# Altium schematic sheet Bottom Layer.SchDoc
size A
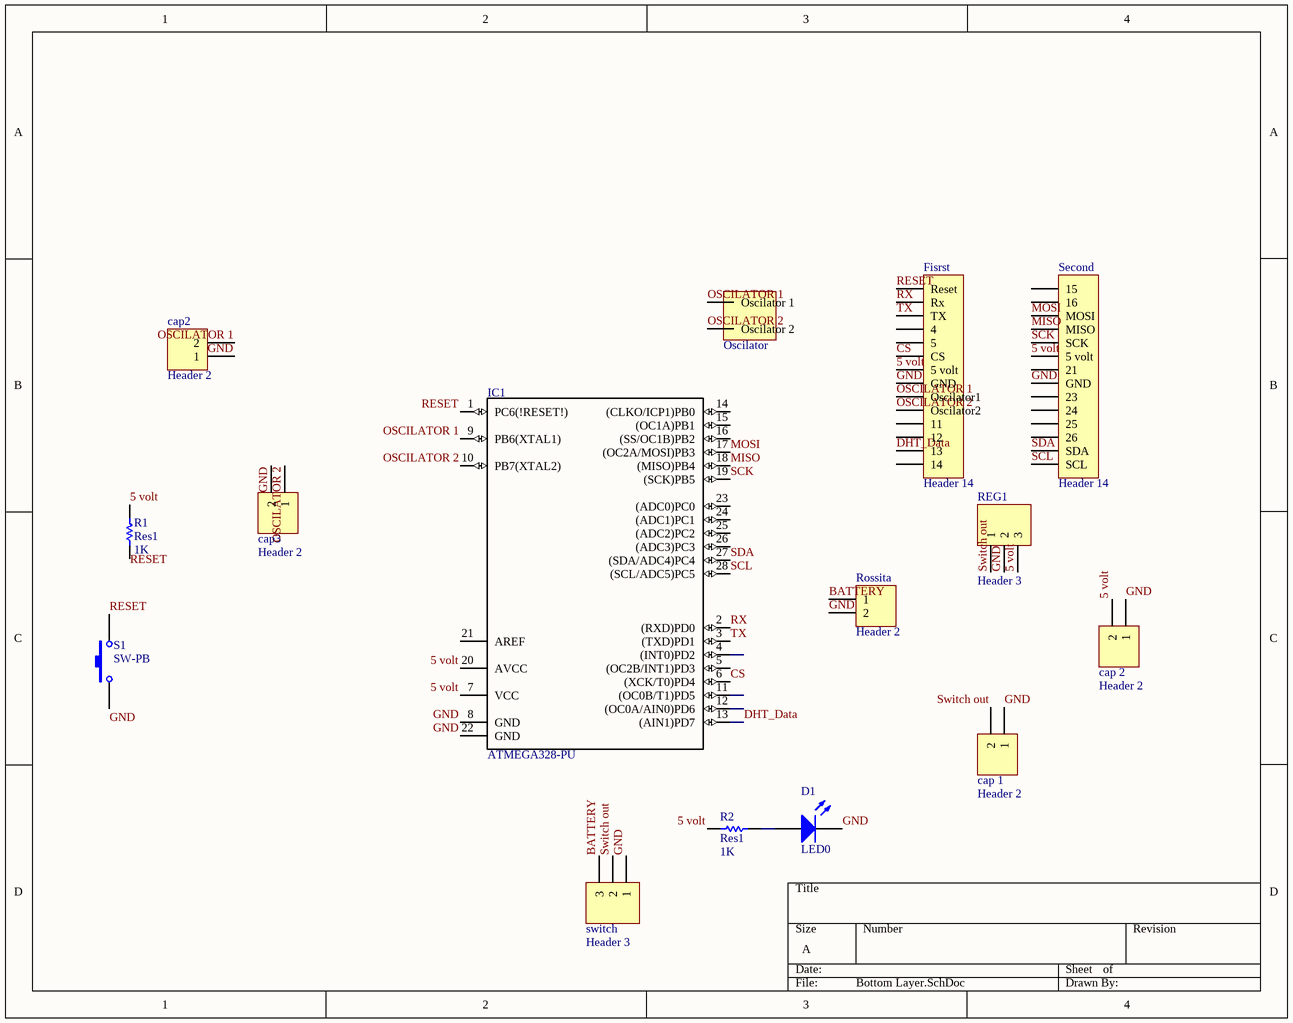
[diagram p0: Bottom Layer.SchDoc]

## Parts
cap2  Header 2  [HDR1X2]
cap3  Header 2  [HDR1X2]
cap_1  Header 2  [HDR1X2]
cap_2  Header 2  [HDR1X2]
D1  LED0  [LED-0]
Fisrst  Header 14  [HDR1X14]
IC1  ATMEGA328-PU  [*DIL28]
Oscilator1  Oscilator  [Oscilator]
R1  Res1  value 1K  [AXIAL-0.3]
R2  Res1  value 1K  [AXIAL-0.3]
REG1  Header 3  [HDR1X3]
Rossita  Header 2  [HDR1X2]
S1  SW-PB  [SPST-2]
Second  Header 14  [HDR1X14]
switch  Header 3  [HDR1X3]

## Nets
5 volt: cap_2.2 Fisrst.7(5_volt) IC1.7(VCC) IC1.20(AVCC) R1.2 R2.1 REG1.3 Second.6(5_volt)
BATTERY: Rossita.1 switch.3
CS: Fisrst.6(CS) IC1.6((XCK/T0)PD4)
DHT_Data: Fisrst.13 IC1.13((AIN1)PD7)
GND: cap2.1 cap3.2 cap_1.1 cap_2.1 D1.2(K) Fisrst.8(GND) IC1.8(GND) IC1.22(GND) REG1.2 Rossita.2 S1.1 Second.8(GND) switch.1
MISO: IC1.18((MISO)PB4) Second.4(MISO)
MOSI: IC1.17((OC2A/MOSI)PB3) Second.3(MOSI)
OSCILATOR 1: cap2.2 Fisrst.9(Oscilator1) IC1.9(PB6(XTAL1)) Oscilator1.Oscilator1(Oscilator_1)
OSCILATOR 2: cap3.1 Fisrst.10(Oscilator2) IC1.10(PB7(XTAL2)) Oscilator1.Oscilator2(Oscilator_2)
RESET: Fisrst.1(Reset) IC1.1(PC6(!RESET!)) R1.1 S1.2
RX: Fisrst.2(Rx) IC1.2((RXD)PD0)
SCK: IC1.19((SCK)PB5) Second.5(SCK)
SCL: IC1.28((SCL/ADC5)PC5) Second.14(SCL)
SDA: IC1.27((SDA/ADC4)PC4) Second.13(SDA)
Switch out: cap_1.2 REG1.1 switch.2
TX: Fisrst.3(TX) IC1.3((TXD)PD1)
NetD1_1: D1.1(A) R2.2

Not connected (* = marked no-connect by the designer): Fisrst 4 5 11 12 14; IC1 4((INT0)PD2) 5((OC2B/INT1)PD3) 11((OC0B/T1)PD5) 12((OC0A/AIN0)PD6) 14((CLKO/ICP1)PB0) 15((OC1A)PB1) 16((SS/OC1B)PB2) 21(AREF) 23((ADC0)PC0) 24((ADC1)PC1) 25((ADC2)PC2) 26((ADC3)PC3); Second 1(15) 2(16) 7(21) 9(23) 10(24) 11(25) 12(26)

## Library data of the parts
cap2 cap3 cap_1 cap_2 Rossita = Header 2: Header, 2-Pin; LatestRevisionDate: 17-Jul-2002; LatestRevisionNote: Re-released for DXP Platform.; Publisher: Altium Limited
D1 = LED0: Typical INFRARED GaAs LED; Published: 8-Jun-2000; LatestRevisionDate: 08-Jul-2005; LatestRevisionNote: Mech Layer 1 removed.; PackageReference: LED-0; Publisher: Altium Limited; PackageDescription: LED; 2 Leads
Fisrst Second = Header 14: Header, 14-Pin; LatestRevisionDate: 17-Jul-2002; LatestRevisionNote: Re-released for DXP Platform.; Publisher: Altium Limited
IC1 = ATMEGA328-PU: ATmega Series 20 MHz 32 KB Flash 2 KB SRAM 8-Bit Microcontroller - DIP-28; MF: Microchip; Package: PDIP-28 Microchip; Price: None; MP: ATMEGA328-PU; SnapEDA_Link: https://www.snapeda.com/parts/ATMEGA328-PU/Microchip/view-part/?ref=snap; Availability: Unavailable; Value: *
Oscilator1 = Component_1
R1 R2 = Res1: Resistor; Published: 8-Jun-2000; LatestRevisionDate: 17-Jul-2002; LatestRevisionNote: Re-released for DXP Platform.; PackageReference: AXIAL-0.3; Publisher: Altium Limited; PackageDescription: Axial Device, Thru-Hole; 2 Leads; 0.3 in Pin Spacing
REG1 switch = Header 3: Header, 3-Pin; LatestRevisionDate: 17-Jul-2002; LatestRevisionNote: Re-released for DXP Platform.; Publisher: Altium Limited
S1 = SW-PB: Switch; Published: 24-Mar-1999; LatestRevisionDate: 17-Jul-2002; LatestRevisionNote: Re-released for DXP Platform.; PackageReference: SPST-2; Publisher: Altium Limited; PackageDescription: Switch; 2 Leads